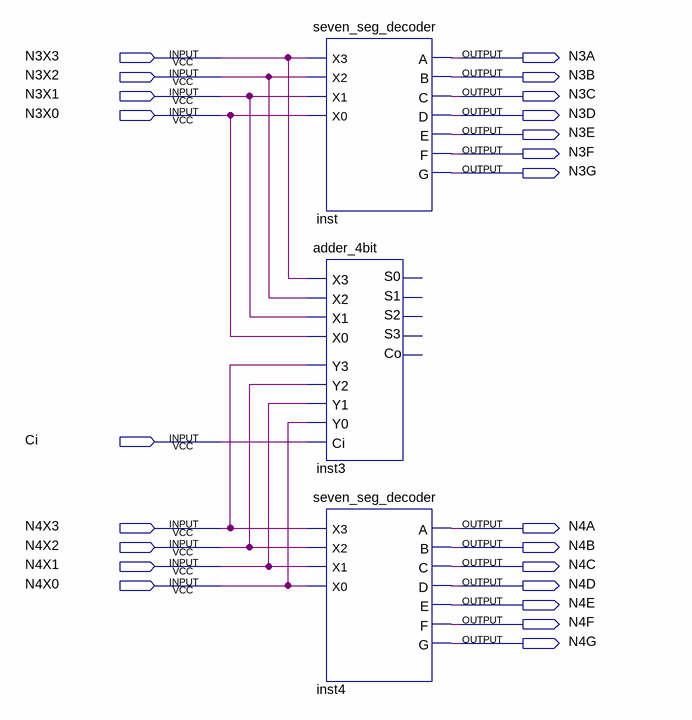
[diagram p0: schematic sheet]
// Quartus schematic lab6.bdf as structural Verilog: 3 symbols, 23 pins
module lab6 (
  input  N3X3,
  input  N3X2,
  input  N3X1,
  input  N3X0,
  input  Ci,
  input  N4X3,
  input  N4X2,
  input  N4X1,
  input  N4X0,
  output N3A,
  output N3B,
  output N3C,
  output N3D,
  output N3E,
  output N3F,
  output N3G,
  output N4A,
  output N4B,
  output N4C,
  output N4D,
  output N4E,
  output N4F,
  output N4G
);

  seven_seg_decoder inst (
    .X3(N3X3), .X2(N3X2), .X1(N3X1), .X0(N3X0), .A(N3A), .B(N3B), .C(N3C), .D(N3D), .E(N3E), .F(N3F), .G(N3G));
  adder_4bit inst3 (
    .X3(N3X3), .Y3(N4X3), .X2(N3X2), .Y2(N4X2), .X1(N3X1), .Y1(N4X1), .X0(N3X0), .Y0(N4X0), .Ci(Ci));  // open: S0, S1, S2, S3, Co
  seven_seg_decoder inst4 (
    .X3(N4X3), .X2(N4X2), .X1(N4X1), .X0(N4X0), .A(N4A), .B(N4B), .C(N4C), .D(N4D), .E(N4E), .F(N4F), .G(N4G));
endmodule
